# EAGLE design billdetect_ring2 (EAGLE 6.5.0)
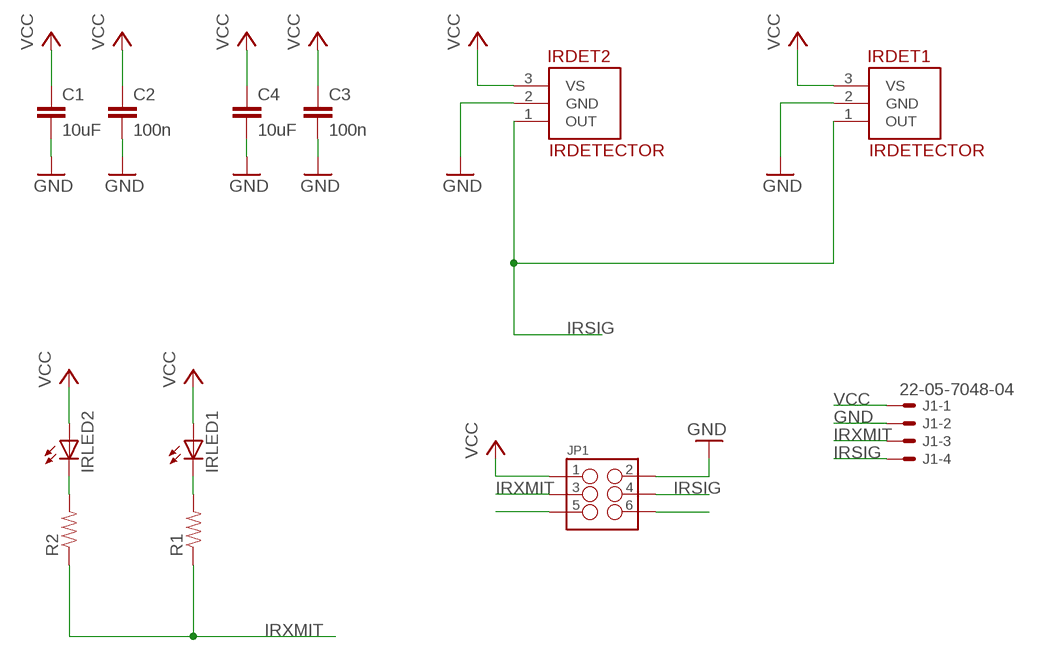
[diagram p0: schematic, sheet 1]

## Parts
C1  10uF  CAP0805  [0805]
C2  100n  CAP0805  [0805]
C3  100n  CAP0805  [0805]
C4  10uF  CAP0805  [0805]
IRDET1  IRDETECTOR  [TSOP-3PIN-2.54MM]
IRDET2  IRDETECTOR  [TSOP-3PIN-2.54MM]
IRLED1  LED-5MM-90DEG  [LED-5MM-90DEG]
IRLED2  LED-5MM-90DEG  [LED-5MM-90DEG]
J1  22-05-7048-04  [7395-04]
JP1  M03X22X3_SILK_SM  [2X3]
R1  RESISTOR0805-RES  [0805]
R2  RESISTOR0805-RES  [0805]

## Nets
GND: C1.2 C2.2 C3.2 C4.2 IRDET1.2(GND) IRDET2.2(GND) J1.2 JP1.2
IRSIG: IRDET1.1(OUT) IRDET2.1(OUT) J1.4 JP1.4
IRXMIT: J1.3 JP1.3 R1.1 R2.1
N$1: IRLED2.K(C) R2.2
N$3: IRLED1.K(C) R1.2
N$5: JP1.5
N$6: JP1.6
VCC: C1.1 C2.1 C3.1 C4.1 IRDET1.3(VS) IRDET2.3(VS) IRLED1.A IRLED2.A J1.1 JP1.1

## Library data of the parts
C1-C4 = SparkFun-20110517:CAP: Capacitor Standard 0603 ceramic capacitor, and 0.1" leaded capacitor.
IRDET1 IRDET2 = todstuff:IRDETECTOR: Vishay TSOP348.., TSOP344.. IR receiver modules CARRIER FREQUENCY STD (AGC2,AGC8) NOISY ENV(AGC4) 30 kHz TSOP34830 TSOP34430 33 kHz TSOP34833 TSOP34433 36 kHz TSOP34836 TSOP34436 38 kHz TSOP34838 TSOP34438 40 kHz TSOP34840 TSOP34440 56 kHz TSOP34856 TSOP34456
IRLED1 IRLED2 = dp_devices:LED: Light Emitting Diode
J1 = con-molex:22-?-04: CONNECTOR wire to board 2.54 mm (.1 inch) pitch header; OC_FARNELL: unknown; OC_NEWARK: unknown
JP1 = SparkFun-Connectors:M03X2: 2x3 .1" header. Shrouded, with keying- CONN-10681 SMT- CONN-11415 Pogo pins- HW-11044
R1 R2 = SparkFun-Passives:RESISTOR: Resistor Basic schematic elements and footprints for 0603, 1206, and PTH resistors.

## Board
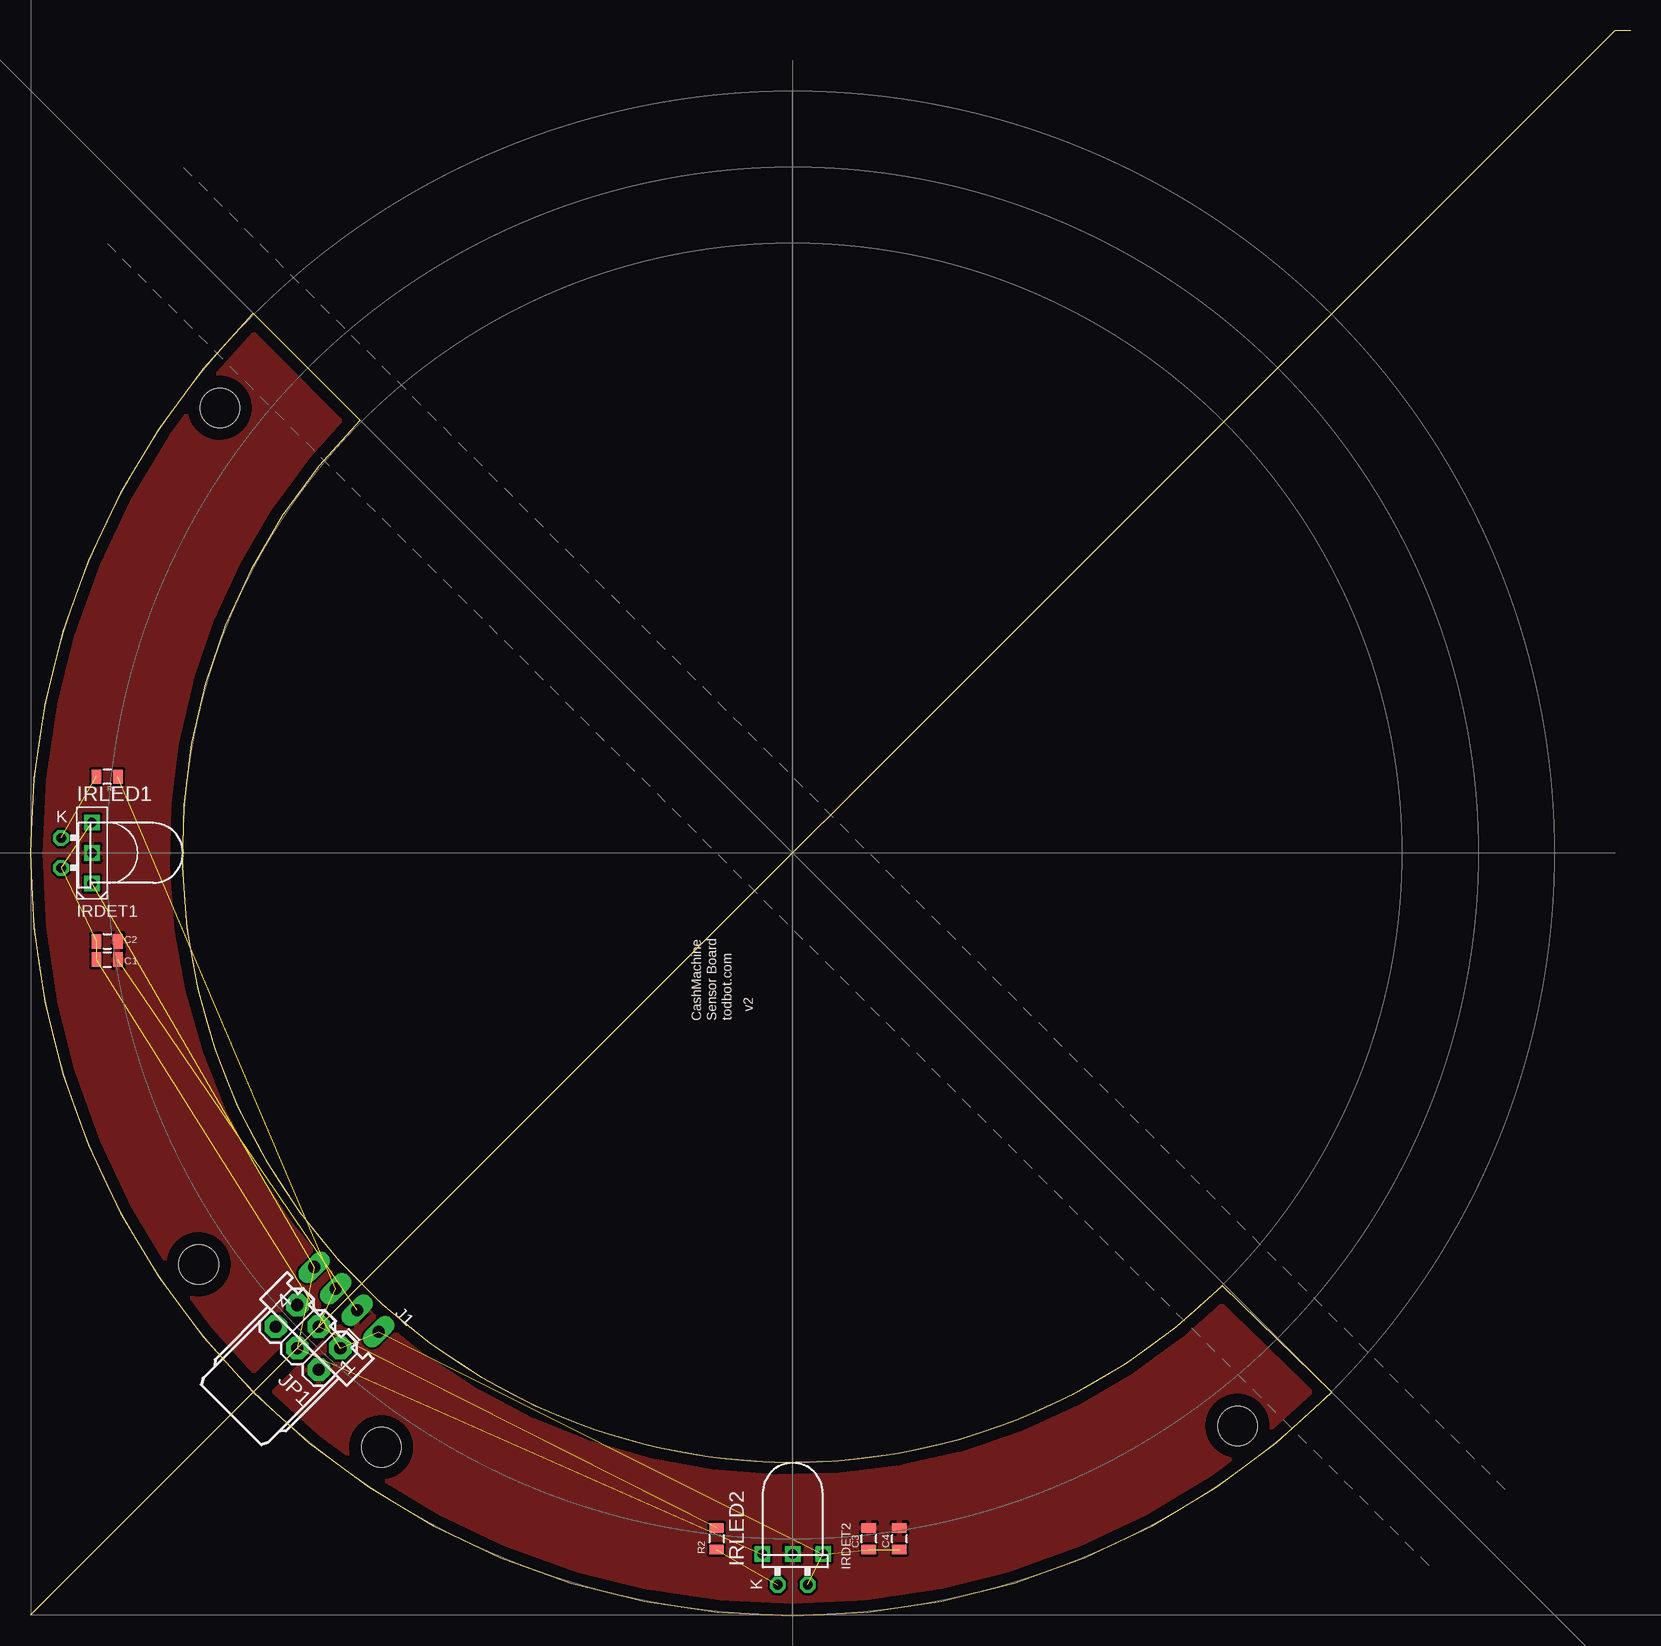
[diagram p1: board, top side]
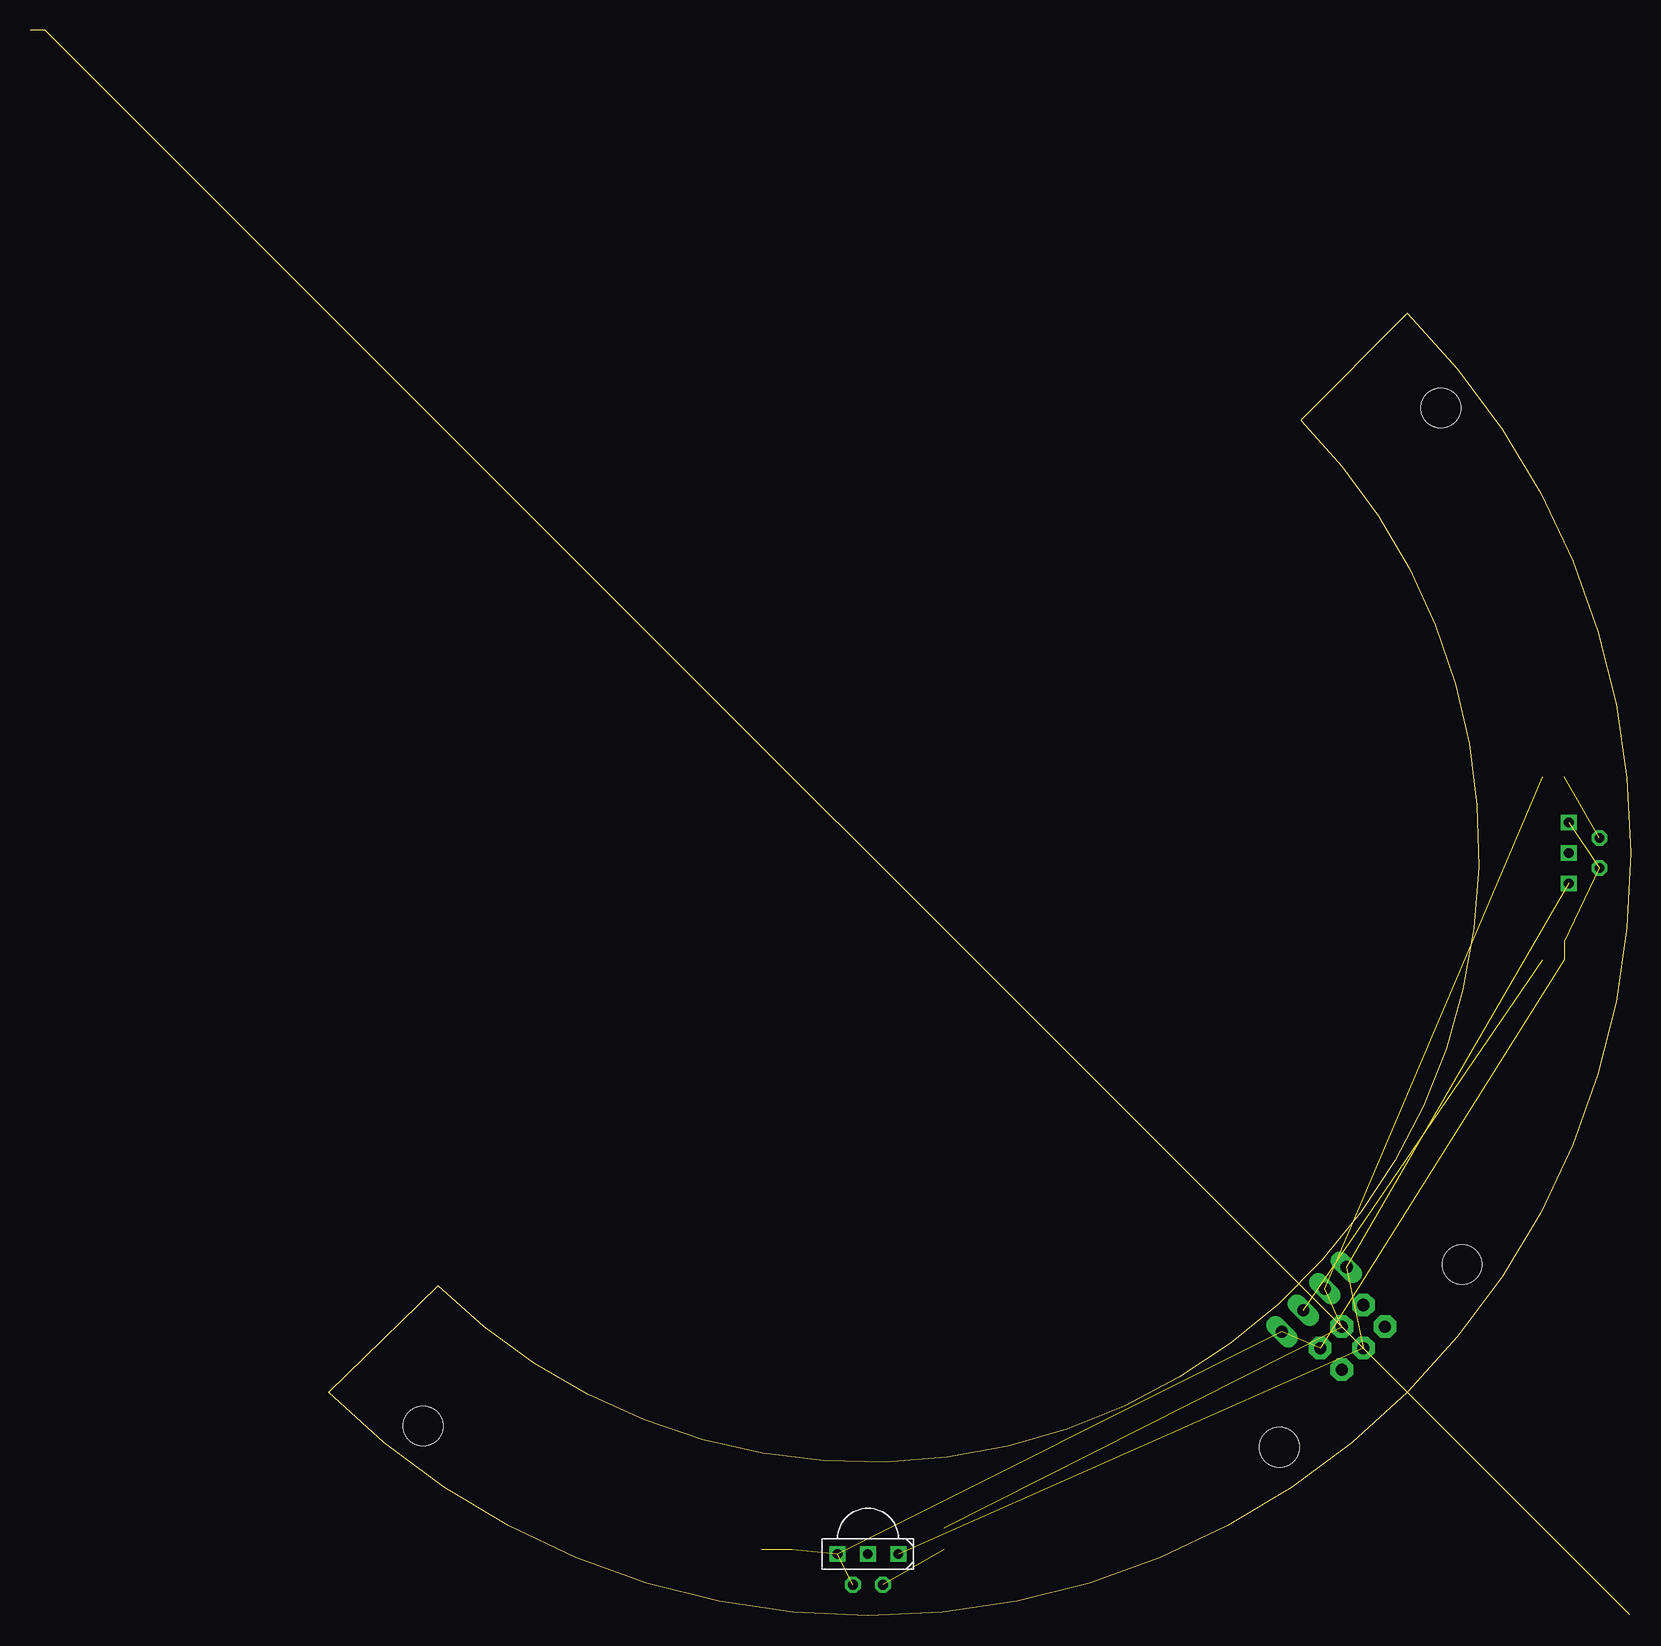
[diagram p2: board, bottom side, seen from below]

Size 133.43 x 132.16 mm. Coordinates in mm from the lower left corner, seen from the top.
Outline: 0.08,0.08 132.16,132.16 133.43,132.16
Outline: 27.51,99.65 arc180 99.39,27.51 108.54,18.62 arc-180 18.62,108.54 27.51,99.65
Copper layers (1*16): Top 0.035mm / dielectric 1.5mm / Bottom 0.035mm
Design rules "default": minimum track width 10mil, minimum drill 24mil, track to track 8mil, track to pad 8mil, pad to pad 8mil, via to via 8mil, smd to smd 8mil, copper to edge 40mil, drill to drill 8mil, minimum pad ring 10mil, minimum via ring 8mil, stop-mask expansion 4mil, vias tented up to drill 0mil, thermal gap 10mil

### Footprints (pad centres in the part's own frame; a part is rotated, then mirrored left to right if it is on the bottom)
0805 = smd 0.8 x 1.2: 1 -0.9,0; 2 0.9,0
TSOP-3PIN-2.54MM = drill 0.8 square: 1 5.08,0; 2 2.54,0; 3 0,0
LED-5MM-90DEG = drill 0.813 octagon: A 5.1,1.25; K 5.1,-1.25
7395-04 = drill 1.016 long: 1 3.81,0; 2 1.27,0; 3 -1.27,0; 4 -3.81,0
2X3 = drill 1.016 pad 1.88 octagon: 1 0,0; 2 0,2.54; 3 2.54,0; 4 2.54,2.54; 5 5.08,0; 6 5.08,2.54
STAND-OFF = hole 3.302: 0,0

### Placement (x,y rotation side)
C1  6.43,54.69 0 top
C2  6.43,56.21 0 top
C3  69.93,6.43 90 top
C4  72.47,6.43 90 top
IRDET1  5.16,66.12 270 top
IRDET2  66.12,5.16 0 bottom
IRLED1  7.7,63.58 180 top
IRLED2  63.58,7.7 270 top
J1  26.38,26.38 315 top
JP1  25.87,22.31 135 top
R1  6.43,69.93 180 top
R2  57.23,6.43 270 top
U$1  [STAND-OFF]  100.66,15.83 0 top
U$3  [STAND-OFF]  15.83,100.66 0 top
U$5  [STAND-OFF]  14.05,29.29 0 top
U$6  [STAND-OFF]  29.29,14.05 0 top

### Tracks (layer width: path | path; a pad name or v marks a point on that pad's centre or on a via)
GND  (1 unrouted)
  pour Top: -6.27,71.2 -6.27,-3.73 105.49,-3.73 105.49,1.35 106.76,1.35 106.76,54.69 82.63,54.69 21.67,115.65 -3.73,90.25 -3.73,73.74
IRSIG  (3 unrouted)
IRXMIT  (3 unrouted)
N$1  (1 unrouted)
N$3  (1 unrouted)
VCC  (9 unrouted)

### Text on the board
tPlace: todbot.com | v2
tNames: CashMachine | Sensor Board